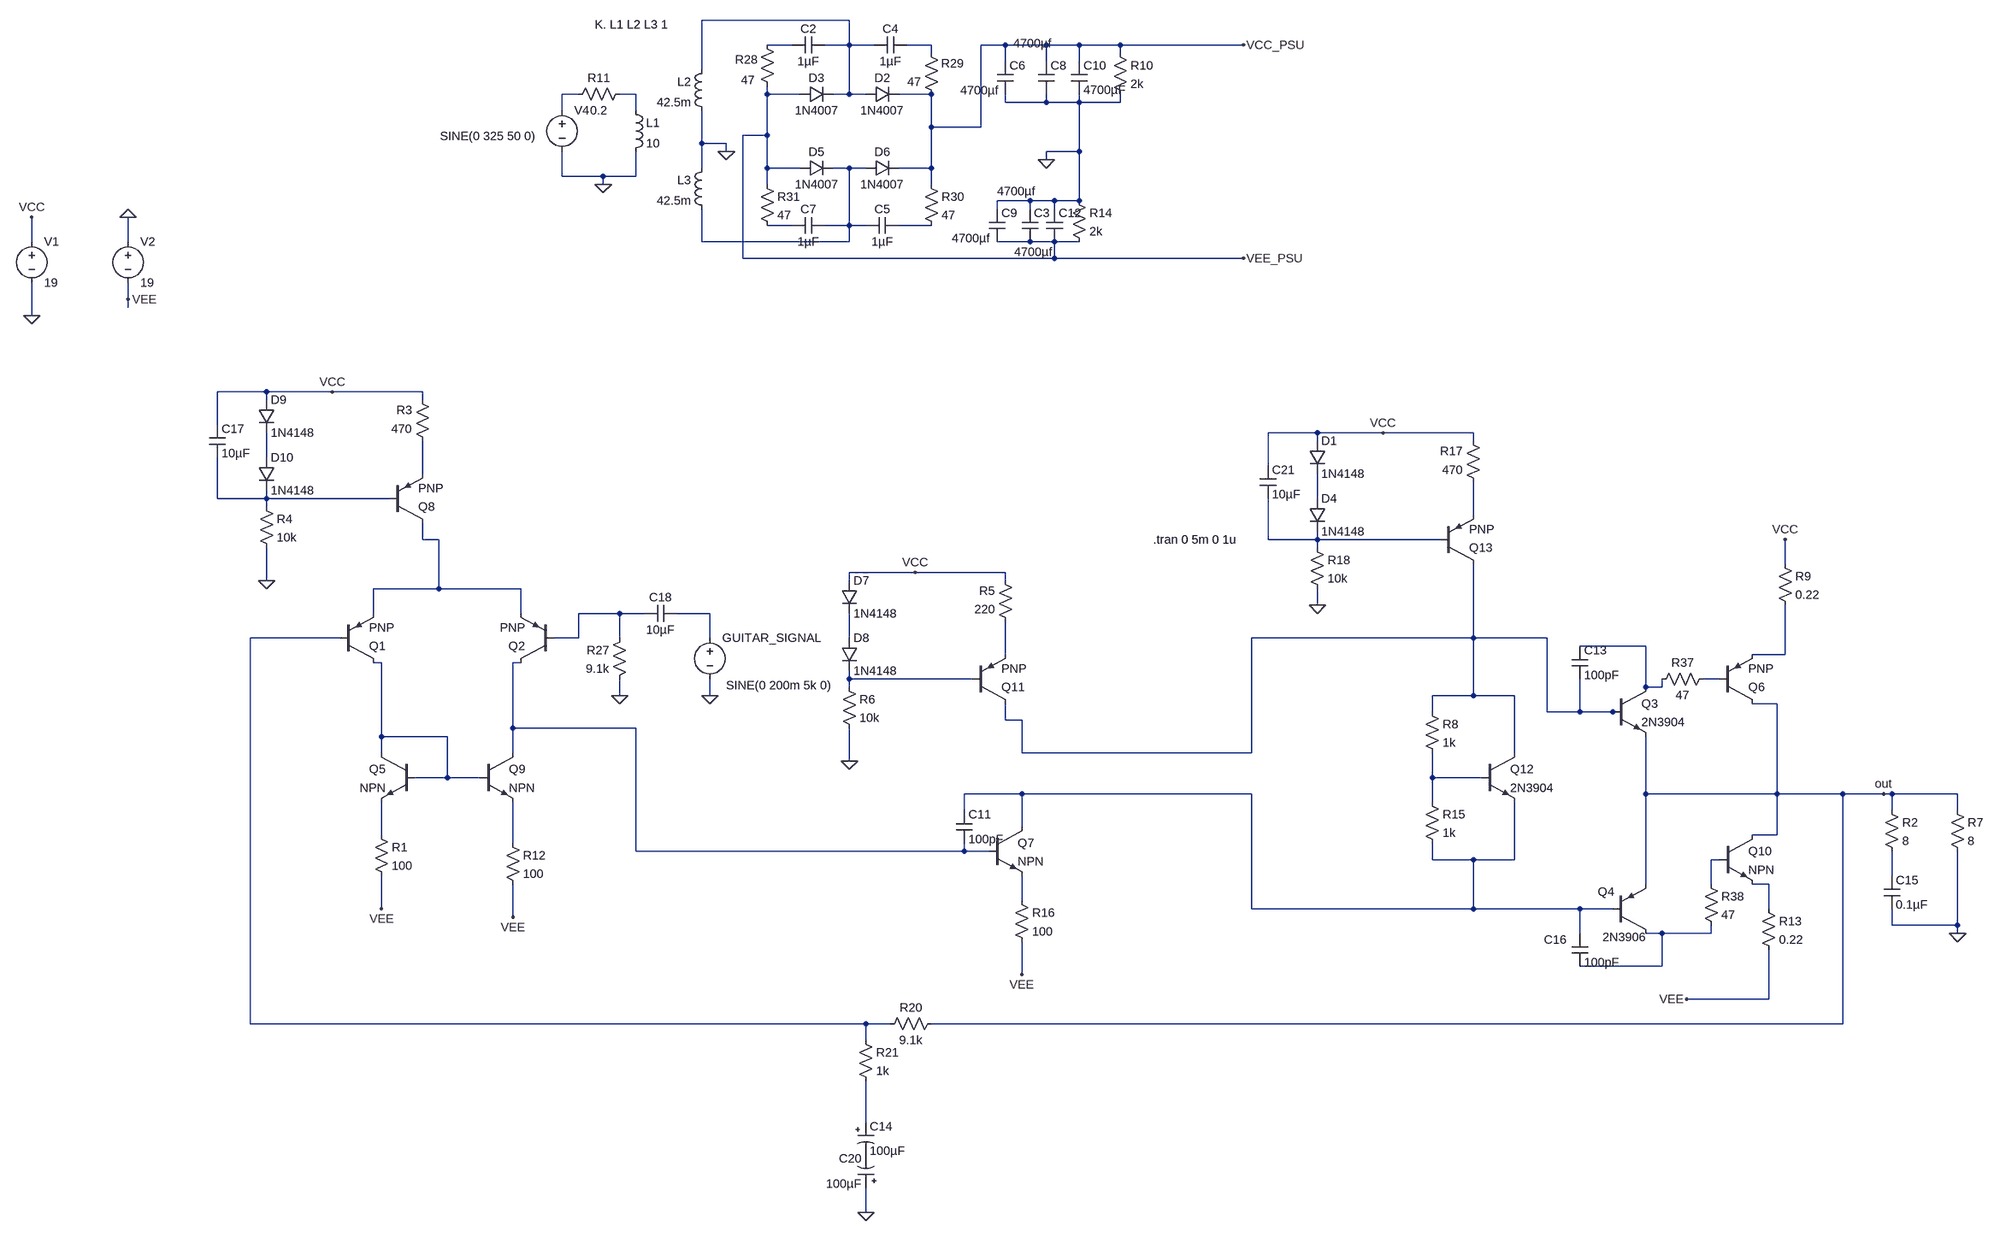
[diagram p0: schematic class_ab_audio_power_amp.asc]
class_ab_audio_power_amp.asc, the LTspice schematic file:
Version 4.1
SHEET 1 3256 1268
WIRE 1024 -1088 736 -1088
WIRE 912 -1040 864 -1040
WIRE 1024 -1040 1024 -1088
WIRE 1024 -1040 976 -1040
WIRE 1072 -1040 1024 -1040
WIRE 1184 -1040 1136 -1040
WIRE 1328 -1040 1280 -1040
WIRE 1408 -1040 1328 -1040
WIRE 1472 -1040 1408 -1040
WIRE 1552 -1040 1472 -1040
WIRE 1792 -1040 1552 -1040
WIRE 1184 -1024 1184 -1040
WIRE 1552 -1024 1552 -1040
WIRE 1328 -1008 1328 -1040
WIRE 1408 -1008 1408 -1040
WIRE 1472 -1008 1472 -1040
WIRE 736 -992 736 -1088
WIRE 496 -944 464 -944
WIRE 608 -944 576 -944
WIRE 864 -944 864 -960
WIRE 928 -944 864 -944
WIRE 1024 -944 1024 -1040
WIRE 1024 -944 992 -944
WIRE 1056 -944 1024 -944
WIRE 1184 -944 1120 -944
WIRE 1328 -928 1328 -944
WIRE 1408 -928 1408 -944
WIRE 1408 -928 1328 -928
WIRE 1472 -928 1472 -944
WIRE 1472 -928 1408 -928
WIRE 1552 -928 1552 -944
WIRE 1552 -928 1472 -928
WIRE 464 -912 464 -944
WIRE 608 -912 608 -944
WIRE 1184 -880 1184 -944
WIRE 1280 -880 1280 -1040
WIRE 1280 -880 1184 -880
WIRE 864 -864 864 -944
WIRE 864 -864 816 -864
WIRE 736 -848 736 -912
WIRE 784 -848 736 -848
WIRE 784 -832 784 -848
WIRE 1472 -832 1472 -928
WIRE 1472 -832 1408 -832
WIRE 1408 -816 1408 -832
WIRE 736 -800 736 -848
WIRE 864 -800 864 -864
WIRE 928 -800 864 -800
WIRE 1024 -800 992 -800
WIRE 1056 -800 1024 -800
WIRE 1184 -800 1184 -880
WIRE 1184 -800 1120 -800
WIRE 464 -784 464 -832
WIRE 544 -784 464 -784
WIRE 608 -784 608 -832
WIRE 608 -784 544 -784
WIRE 544 -768 544 -784
WIRE 864 -768 864 -800
WIRE 1184 -768 1184 -800
WIRE 1376 -736 1312 -736
WIRE 1424 -736 1376 -736
WIRE 1472 -736 1472 -832
WIRE 1472 -736 1424 -736
WIRE 1312 -720 1312 -736
WIRE 1376 -720 1376 -736
WIRE 1424 -720 1424 -736
WIRE 912 -688 864 -688
WIRE 1024 -688 1024 -800
WIRE 1024 -688 976 -688
WIRE 1056 -688 1024 -688
WIRE 1184 -688 1120 -688
WIRE -688 -656 -688 -704
WIRE -432 -656 -432 -704
WIRE 736 -656 736 -720
WIRE 1024 -656 1024 -688
WIRE 1024 -656 736 -656
WIRE 1376 -656 1312 -656
WIRE 1424 -656 1376 -656
WIRE 1472 -656 1424 -656
WIRE 816 -624 816 -864
WIRE 1424 -624 1424 -656
WIRE 1424 -624 816 -624
WIRE 1792 -624 1424 -624
WIRE -432 -544 -432 -576
WIRE -432 -528 -432 -544
WIRE -688 -512 -688 -576
WIRE -112 -352 -208 -352
WIRE 16 -352 -112 -352
WIRE 192 -352 16 -352
WIRE -112 -336 -112 -352
WIRE 192 -336 192 -352
WIRE -208 -288 -208 -352
WIRE 1936 -272 1840 -272
WIRE 2064 -272 1936 -272
WIRE 2240 -272 2064 -272
WIRE 1936 -256 1936 -272
WIRE 2240 -256 2240 -272
WIRE -112 -224 -112 -272
WIRE 1840 -208 1840 -272
WIRE 192 -192 192 -256
WIRE -208 -144 -208 -224
WIRE -112 -144 -112 -160
WIRE -112 -144 -208 -144
WIRE 128 -144 -112 -144
WIRE 1936 -144 1936 -192
WIRE -112 -128 -112 -144
WIRE 2240 -112 2240 -176
WIRE 192 -64 192 -96
WIRE 224 -64 192 -64
WIRE 1840 -64 1840 -144
WIRE 1936 -64 1936 -80
WIRE 1936 -64 1840 -64
WIRE 2176 -64 1936 -64
WIRE 1936 -48 1936 -64
WIRE 2848 -16 2848 -64
WIRE 1152 0 1024 0
WIRE 1328 0 1152 0
WIRE -112 16 -112 -48
WIRE 1024 16 1024 0
WIRE 1328 16 1328 0
WIRE 224 32 224 -64
WIRE 224 32 96 32
WIRE 384 32 224 32
WIRE 1936 64 1936 32
WIRE 96 80 96 32
WIRE 384 80 384 32
WIRE 576 80 496 80
WIRE 624 80 576 80
WIRE 752 80 688 80
WIRE 32 128 -144 128
WIRE 496 128 496 80
WIRE 496 128 448 128
WIRE 576 128 576 80
WIRE 752 128 752 80
WIRE 1024 128 1024 80
WIRE 2240 128 2240 -16
WIRE 2240 128 1808 128
WIRE 2384 128 2240 128
WIRE 2576 144 2448 144
WIRE 1328 160 1328 96
WIRE 2848 160 2848 64
WIRE 2848 160 2784 160
WIRE 112 176 96 176
WIRE 384 176 368 176
WIRE 1024 208 1024 192
WIRE 1264 208 1024 208
WIRE 2720 208 2688 208
WIRE 1024 224 1024 208
WIRE 2576 224 2576 144
WIRE 2608 224 2608 208
WIRE 2608 224 2576 224
WIRE 576 240 576 208
WIRE 752 240 752 208
WIRE 2240 240 2240 128
WIRE 2240 240 2160 240
WIRE 2320 240 2240 240
WIRE 2832 256 2784 256
WIRE 2160 272 2160 240
WIRE 2384 272 2384 128
WIRE 2448 272 2448 208
WIRE 2448 272 2384 272
WIRE 2512 272 2448 272
WIRE 2528 272 2512 272
WIRE 1328 288 1328 256
WIRE 1360 288 1328 288
WIRE 368 304 368 176
WIRE 608 304 368 304
WIRE 112 320 112 176
WIRE 240 320 112 320
WIRE 112 352 112 320
WIRE 368 352 368 304
WIRE 1360 352 1360 288
WIRE 1808 352 1808 128
WIRE 1808 352 1360 352
WIRE 2320 352 2320 240
WIRE 1024 368 1024 304
WIRE 240 400 240 320
WIRE 240 400 176 400
WIRE 304 400 240 400
WIRE 2160 400 2160 352
WIRE 2256 400 2160 400
WIRE 1360 432 1248 432
WIRE 1808 432 1360 432
WIRE 2576 432 2576 320
WIRE 2832 432 2832 256
WIRE 2832 432 2576 432
WIRE 2960 432 2832 432
WIRE 3040 432 2960 432
WIRE 3056 432 3040 432
WIRE 3184 432 3056 432
WIRE 2160 448 2160 400
WIRE 1248 464 1248 432
WIRE 3056 464 3056 432
WIRE 3184 464 3184 432
WIRE 1360 496 1360 432
WIRE 112 512 112 448
WIRE 2832 512 2832 432
WIRE 2832 512 2784 512
WIRE 368 528 368 448
WIRE 608 544 608 304
WIRE 1248 544 1248 528
WIRE 1248 544 608 544
WIRE 1296 544 1248 544
WIRE 2160 560 2160 528
WIRE 2240 560 2160 560
WIRE 2320 560 2320 448
WIRE 2320 560 2240 560
WIRE 2720 560 2704 560
WIRE 3056 592 3056 544
WIRE 2576 608 2576 432
WIRE 2704 608 2704 560
WIRE 2816 608 2784 608
WIRE 1360 640 1360 592
WIRE 112 656 112 592
WIRE 1808 656 1808 432
WIRE 2240 656 2240 560
WIRE 2240 656 1808 656
WIRE 2448 656 2240 656
WIRE 2512 656 2448 656
WIRE 2816 656 2816 608
WIRE 368 672 368 608
WIRE 3056 688 3056 656
WIRE 3184 688 3184 544
WIRE 3184 688 3056 688
WIRE 2448 704 2448 656
WIRE 2608 704 2576 704
WIRE 2704 704 2704 688
WIRE 2704 704 2608 704
WIRE 3184 704 3184 688
WIRE 2608 768 2608 704
WIRE 2608 768 2448 768
WIRE 1360 784 1360 720
WIRE 2816 832 2816 736
WIRE 2816 832 2656 832
WIRE -144 880 -144 128
WIRE 1056 880 -144 880
WIRE 1104 880 1056 880
WIRE 2960 880 2960 432
WIRE 2960 880 1184 880
WIRE 1056 912 1056 880
WIRE 1056 1072 1056 992
WIRE 1056 1248 1056 1200
FLAG 3184 704 0
FLAG 544 -768 0
FLAG 784 -832 0
FLAG 1408 -816 0
FLAG 3040 432 out
FLAG 752 240 0
FLAG 2848 -64 VCC
FLAG 2656 832 VEE
FLAG 1792 -1040 VCC_PSU
FLAG 1792 -624 VEE_PSU
FLAG 368 672 VEE
FLAG 1152 0 VCC
FLAG 1360 784 VEE
FLAG 1056 1248 0
FLAG 576 240 0
FLAG 112 656 VEE
FLAG 1024 368 0
FLAG -688 -704 VCC
FLAG -688 -512 0
FLAG -432 -704 0
FLAG -432 -544 VEE
FLAG 16 -352 VCC
FLAG -112 16 0
FLAG 2064 -272 VCC
FLAG 1936 64 0
SYMBOL npn 2512 224 R0
SYMATTR InstName Q3
SYMATTR Value 2N3904
SYMBOL pnp 2512 704 M180
WINDOW 0 -29 81 Left 2
WINDOW 3 -20 -7 Left 2
SYMATTR InstName Q4
SYMATTR Value 2N3906
SYMBOL res 3168 448 R0
SYMATTR InstName R7
SYMATTR Value 8
SYMBOL ind 592 -928 R0
SYMATTR InstName L1
SYMATTR Value 10
SYMATTR Type ind
SYMATTR SpiceLine Rser=10
SYMBOL ind 752 -1008 M0
SYMATTR InstName L2
SYMATTR Value 42.5m
SYMATTR Type ind
SYMATTR SpiceLine Rser=1
SYMBOL voltage 464 -928 R0
WINDOW 3 -238 66 Left 2
WINDOW 123 0 0 Left 0
WINDOW 39 0 0 Left 0
SYMATTR Value SINE(0 325 50 0)
SYMATTR InstName V4
SYMBOL res 592 -960 R90
WINDOW 0 0 56 VBottom 2
WINDOW 3 32 56 VTop 2
SYMATTR InstName R11
SYMATTR Value 0.2
SYMBOL ind 752 -816 M0
SYMATTR InstName L3
SYMATTR Value 42.5m
SYMATTR Type ind
SYMATTR SpiceLine Rser=1
SYMBOL diode 1056 -928 R270
WINDOW 0 32 32 VTop 2
WINDOW 3 0 32 VBottom 2
SYMATTR InstName D2
SYMATTR Value 1N4007
SYMBOL diode 928 -928 R270
WINDOW 0 32 32 VTop 2
WINDOW 3 0 32 VBottom 2
SYMATTR InstName D3
SYMATTR Value 1N4007
SYMBOL diode 928 -784 R270
WINDOW 0 32 32 VTop 2
WINDOW 3 0 32 VBottom 2
SYMATTR InstName D5
SYMATTR Value 1N4007
SYMBOL diode 1056 -784 R270
WINDOW 0 32 32 VTop 2
WINDOW 3 0 32 VBottom 2
SYMATTR InstName D6
SYMATTR Value 1N4007
SYMBOL res 1536 -1040 R0
SYMATTR InstName R10
SYMATTR Value 2k
SYMBOL res 1200 864 R90
WINDOW 0 0 56 VBottom 2
WINDOW 3 32 56 VTop 2
SYMATTR InstName R20
SYMATTR Value 9.1k
SYMBOL res 1040 896 R0
SYMATTR InstName R21
SYMATTR Value 1k
SYMBOL res 1456 -752 R0
SYMATTR InstName R14
SYMATTR Value 2k
SYMBOL cap 1120 -704 R90
WINDOW 0 0 32 VBottom 2
WINDOW 3 32 32 VTop 2
SYMATTR InstName C5
SYMATTR Value 1µF
SYMBOL res 1168 -784 R0
SYMATTR InstName R30
SYMATTR Value 47
SYMATTR SpiceLine tol=5 pwr=1
SYMBOL res 848 -784 R0
SYMATTR InstName R31
SYMATTR Value 47
SYMATTR SpiceLine tol=5 pwr=1
SYMBOL cap 976 -704 R90
WINDOW 0 0 32 VBottom 2
WINDOW 3 32 32 VTop 2
SYMATTR InstName C7
SYMATTR Value 1µF
SYMBOL cap 1136 -1056 R90
WINDOW 0 0 32 VBottom 2
WINDOW 3 32 32 VTop 2
SYMATTR InstName C4
SYMATTR Value 1µF
SYMBOL res 1200 -928 R180
WINDOW 0 -47 76 Left 2
WINDOW 3 36 40 Left 2
SYMATTR InstName R29
SYMATTR Value 47
SYMATTR SpiceLine tol=5 pwr=1
SYMBOL cap 976 -1056 R90
WINDOW 0 0 32 VBottom 2
WINDOW 3 32 32 VTop 2
SYMATTR InstName C2
SYMATTR Value 1µF
SYMBOL res 848 -1056 R0
WINDOW 0 -47 45 Left 2
WINDOW 3 -35 85 Left 2
SYMATTR InstName R28
SYMATTR Value 47
SYMATTR SpiceLine tol=5 pwr=1
SYMBOL cap 1296 -720 R0
WINDOW 3 -72 57 Left 2
SYMATTR Value 4700µf
SYMATTR InstName C9
SYMBOL cap 1456 -1008 R0
SYMATTR InstName C10
SYMATTR Value 4700µF
SYMBOL cap 1360 -720 R0
WINDOW 3 -48 -35 Left 2
SYMATTR Value 4700µf
SYMATTR InstName C3
SYMBOL cap 1408 -720 R0
WINDOW 3 -63 84 Left 2
SYMATTR Value 4700µf
SYMATTR InstName C12
SYMBOL voltage 752 112 R0
WINDOW 3 32 108 Left 2
WINDOW 123 32 136 Left 2
WINDOW 39 0 0 Left 0
SYMATTR Value SINE(0 200m 5k 0)
SYMATTR InstName GUITAR_SIGNAL
SYMBOL res 2704 192 R90
WINDOW 0 0 56 VBottom 2
WINDOW 3 32 56 VTop 2
SYMATTR InstName R37
SYMATTR Value 47
SYMATTR SpiceLine tol=5
SYMBOL res 2688 592 R0
SYMATTR InstName R38
SYMATTR Value 47
SYMATTR SpiceLine tol=5
SYMBOL cap 1312 -1008 R0
WINDOW 3 -72 57 Left 2
SYMATTR Value 4700µf
SYMATTR InstName C6
SYMBOL cap 1392 -1008 R0
WINDOW 3 -48 -35 Left 2
SYMATTR Value 4700µf
SYMATTR InstName C8
SYMBOL pnp 32 176 M180
SYMATTR InstName Q1
SYMBOL pnp 448 176 R180
SYMATTR InstName Q2
SYMBOL npn 176 352 M0
SYMATTR InstName Q5
SYMBOL npn 304 352 R0
SYMATTR InstName Q9
SYMBOL res 352 512 R0
SYMATTR InstName R12
SYMATTR Value 100
SYMATTR SpiceLine tol=5
SYMBOL npn 1296 496 R0
SYMATTR InstName Q7
SYMBOL res 1344 624 R0
SYMATTR InstName R16
SYMATTR Value 100
SYMATTR SpiceLine tol=5
SYMBOL res 592 112 M0
SYMATTR InstName R27
SYMATTR Value 9.1k
SYMATTR SpiceLine tol=5
SYMBOL cap 1232 464 R0
SYMATTR InstName C11
SYMATTR Value 100pF
SYMBOL res 96 496 R0
SYMATTR InstName R1
SYMATTR Value 100
SYMATTR SpiceLine tol=5
SYMBOL res 3040 448 R0
SYMATTR InstName R2
SYMATTR Value 8
SYMATTR SpiceLine tol=5
SYMBOL cap 3040 592 R0
SYMATTR InstName C15
SYMATTR Value 0.1µF
SYMBOL pnp 2720 256 M180
SYMATTR InstName Q6
SYMBOL npn 2720 512 R0
SYMATTR InstName Q10
SYMBOL pnp 1264 256 M180
SYMATTR InstName Q11
SYMBOL res 1344 112 R180
WINDOW 0 36 76 Left 2
WINDOW 3 36 40 Left 2
SYMATTR InstName R5
SYMATTR Value 220
SYMATTR SpiceLine tol=5
SYMBOL diode 1008 16 R0
SYMATTR InstName D7
SYMATTR Value 1N4148
SYMBOL diode 1008 128 R0
SYMATTR InstName D8
SYMATTR Value 1N4148
SYMBOL res 1008 208 R0
SYMATTR InstName R6
SYMATTR Value 10k
SYMBOL res 2832 -32 R0
SYMATTR InstName R9
SYMATTR Value 0.22
SYMATTR SpiceLine pwr=2
SYMBOL res 2800 640 R0
SYMATTR InstName R13
SYMATTR Value 0.22
SYMATTR SpiceLine pwr=2
SYMBOL cap 2432 144 R0
SYMATTR InstName C13
SYMATTR Value 100pF
SYMBOL cap 2432 704 R0
WINDOW 0 -54 12 Left 2
SYMATTR InstName C16
SYMATTR Value 100pF
SYMBOL voltage -688 -672 R0
WINDOW 123 0 0 Left 0
WINDOW 39 0 0 Left 0
SYMATTR InstName V1
SYMATTR Value 19
SYMBOL voltage -432 -672 R0
WINDOW 123 0 0 Left 0
WINDOW 39 0 0 Left 0
SYMATTR InstName V2
SYMATTR Value 19
SYMBOL pnp 128 -96 M180
SYMATTR InstName Q8
SYMBOL res 208 -240 R180
WINDOW 0 36 76 Left 2
WINDOW 3 36 40 Left 2
SYMATTR InstName R3
SYMATTR Value 470
SYMATTR SpiceLine tol=5
SYMBOL diode -128 -336 R0
SYMATTR InstName D9
SYMATTR Value 1N4148
SYMBOL diode -128 -224 R0
SYMATTR InstName D10
SYMATTR Value 1N4148
SYMBOL res -128 -144 R0
SYMATTR InstName R4
SYMATTR Value 10k
SYMBOL cap -224 -288 R0
SYMATTR InstName C17
SYMATTR Value 10µF
SYMBOL polcap 1040 1072 R0
SYMATTR InstName C14
SYMATTR Value 100µF
SYMBOL polcap 1072 1200 R180
WINDOW 0 24 57 Left 2
WINDOW 3 24 8 Left 2
SYMATTR InstName C20
SYMATTR Value 100µF
SYMBOL res 2144 256 R0
SYMATTR InstName R8
SYMATTR Value 1k
SYMBOL res 2144 432 R0
SYMATTR InstName R15
SYMATTR Value 1k
SYMBOL npn 2256 352 R0
SYMATTR InstName Q12
SYMATTR Value 2N3904
SYMBOL pnp 2176 -16 M180
SYMATTR InstName Q13
SYMBOL res 2256 -160 R180
WINDOW 0 36 76 Left 2
WINDOW 3 36 40 Left 2
SYMATTR InstName R17
SYMATTR Value 470
SYMATTR SpiceLine tol=5
SYMBOL diode 1920 -256 R0
SYMATTR InstName D1
SYMATTR Value 1N4148
SYMBOL diode 1920 -144 R0
SYMATTR InstName D4
SYMATTR Value 1N4148
SYMBOL res 1920 -64 R0
SYMATTR InstName R18
SYMATTR Value 10k
SYMBOL cap 1824 -208 R0
SYMATTR InstName C21
SYMATTR Value 10µF
SYMBOL cap 688 64 R90
WINDOW 0 0 32 VBottom 2
WINDOW 3 32 32 VTop 2
SYMATTR InstName C18
SYMATTR Value 10µF
TEXT 528 -1080 Left 2 !K. L1 L2 L3 1
TEXT 1616 -64 Left 2 !.tran 0 5m 0 1u

The netlist it stands for:
* class_ab_audio_power_amp.asc
Q3 N021 N020 out 0 2N3904
Q4 N036 N029 out 0 2N3906
R7 out 0 8
L1 N005 0 10 Rser=10
L2 N001 0 42.5m Rser=1
V4 N004 0 SINE(0 325 50 0)
R11 N005 N004 0.2
L3 0 N006 42.5m Rser=1
D2 N001 VCC_PSU 1N4007
D3 VEE_PSU N001 1N4007
D5 VEE_PSU N006 1N4007
D6 N006 VCC_PSU 1N4007
R10 VCC_PSU 0 2k
R20 out N018 9.1k
R21 N018 N037 1k
R14 0 VEE_PSU 2k
C5 N008 N006 1µF
R30 VCC_PSU N008 47 tol=5 pwr=1
R31 VEE_PSU N007 47 tol=5 pwr=1
C7 N006 N007 1µF
C4 N003 N001 1µF
R29 VCC_PSU N003 47 tol=5 pwr=1
C2 N001 N002 1µF
R28 N002 VEE_PSU 47 tol=5 pwr=1
C9 0 VEE_PSU 4700µf
C10 VCC_PSU 0 4700µF
C3 0 VEE_PSU 4700µf
C12 0 VEE_PSU 4700µf
V§GUITAR_SIGNAL N017 0 SINE(0 200m 5k 0)
R37 N027 N021 47 tol=5
R38 N032 N036 47 tol=5
C6 VCC_PSU 0 4700µf
C8 VCC_PSU 0 4700µf
Q1 N024 N018 N014 0 PNP
Q2 N025 N016 N014 0 PNP
Q5 N024 N024 N030 0 NPN
Q9 N025 N024 N031 0 NPN
R12 N031 VEE 100 tol=5
Q7 N029 N025 N035 0 NPN
R16 N035 VEE 100 tol=5
R27 N016 0 9.1k tol=5
C11 N029 N025 100pF
R1 N030 VEE 100 tol=5
R2 out N033 8 tol=5
C15 N033 0 0.1µF
Q6 out N027 N023 0 PNP
Q10 out N032 N034 0 NPN
Q11 N020 N026 N022 0 PNP
R5 N022 VCC 220 tol=5
D7 VCC N019 1N4148
D8 N019 N026 1N4148
R6 N026 0 10k
R9 VCC N023 0.22 pwr=2
R13 N034 VEE 0.22 pwr=2
C13 N021 N020 100pF
C16 N029 N036 100pF
V1 VCC 0 19
V2 0 VEE 19
Q8 N014 N011 N010 0 PNP
R3 N010 VCC 470 tol=5
D9 VCC N009 1N4148
D10 N009 N011 1N4148
R4 N011 0 10k
C17 VCC N011 10µF
C14 N037 P001 100µF
C20 0 P001 100µF
R8 N020 N028 1k
R15 N028 N029 1k
Q12 N020 N028 N029 0 2N3904
Q13 N020 N015 N013 0 PNP
R17 N013 VCC 470 tol=5
D1 VCC N012 1N4148
D4 N012 N015 1N4148
R18 N015 0 10k
C21 VCC N015 10µF
C18 N017 N016 10µF
.model D D
.lib standard.dio
.model NPN NPN
.model PNP PNP
.lib standard.bjt
K. L1 L2 L3 1
.tran 0 5m 0 1u
.backanno
.end